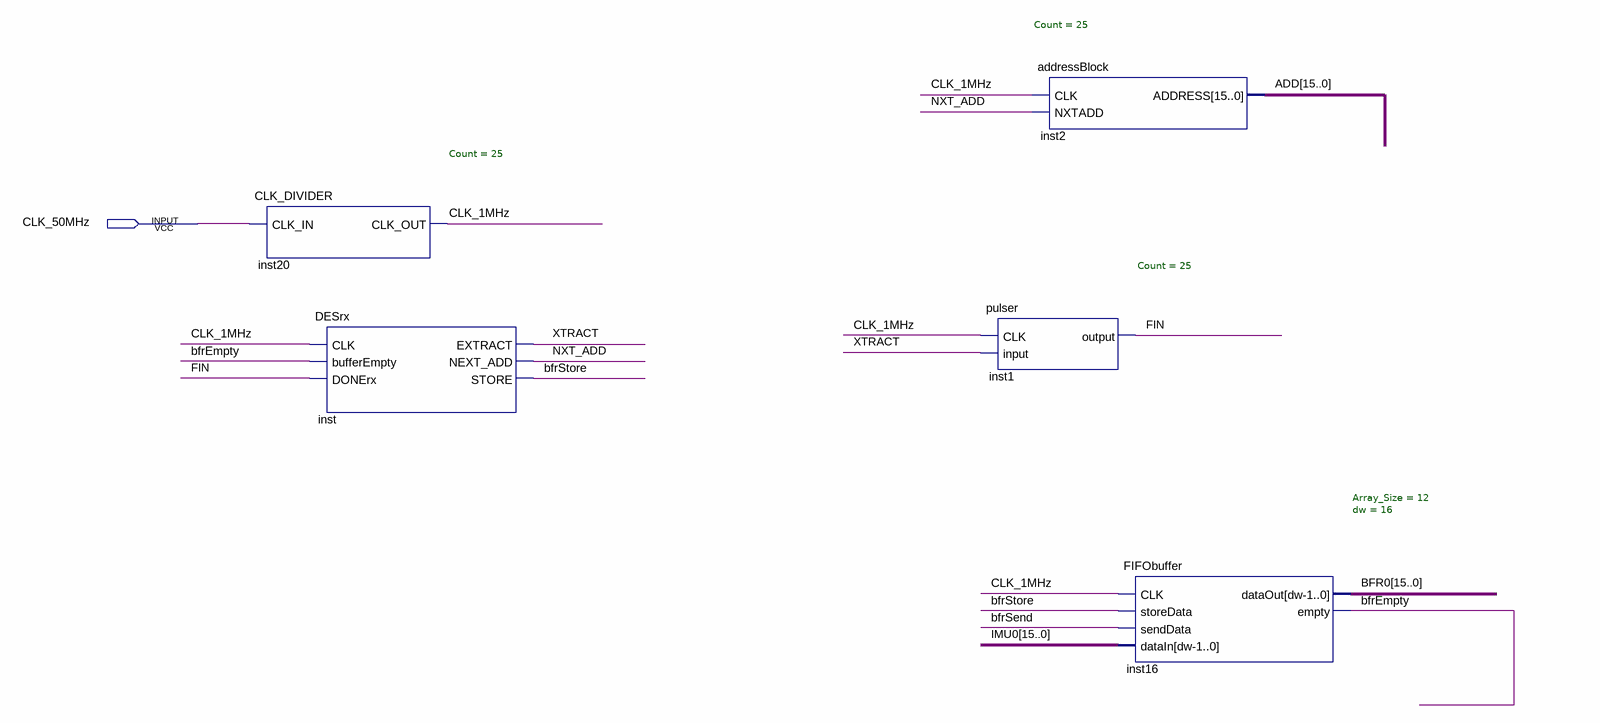
[diagram p0: schematic sheet]
// Quartus schematic ReadMPU.bdf as structural Verilog: 5 symbols, 1 pins
module ReadMPU (
  input  CLK_50MHz
);

  wire bfrEmpty, bfrSend, bfrStore, CLK_1MHz, FIN, NXT_ADD, XTRACT;
  wire [15:0] ADD, BFR0, IMU0;

  CLK_DIVIDER #(.Count(25)) inst20 (.CLK_IN(CLK_50MHz), .CLK_OUT(CLK_1MHz));
  DESrx inst (
    .CLK(CLK_1MHz), .bufferEmpty(bfrEmpty), .DONErx(FIN), .EXTRACT(XTRACT), .NEXT_ADD(NXT_ADD),
    .STORE(bfrStore));
  pulser #(.Count(25)) inst1 (.CLK(CLK_1MHz), .\input (XTRACT), .\output (FIN));
  addressBlock #(.Count(25)) inst2 (.CLK(CLK_1MHz), .NXTADD(NXT_ADD), .ADDRESS(ADD));
  FIFObuffer #(.Array_Size(12), .dw(16)) inst16 (
    .CLK(CLK_1MHz), .storeData(bfrStore), .sendData(bfrSend), .dataIn(IMU0), .dataOut(BFR0), .empty(bfrEmpty));
endmodule
